# Altium project CP100-(5V1A)_V1.0.PrjPCB
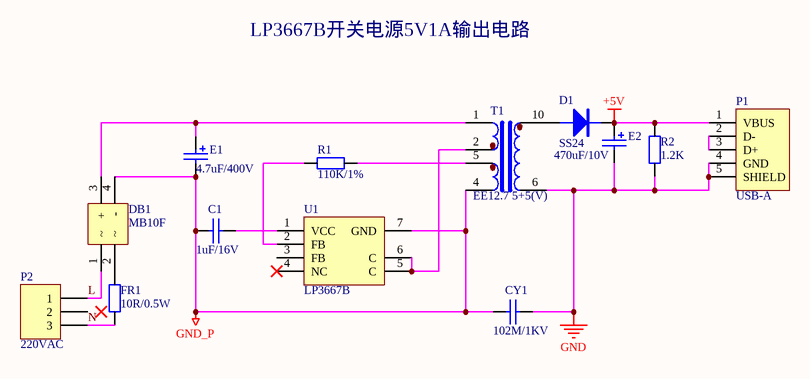
[diagram p0: CP100-(5V1A)_V1.0.SchDoc]
1 sheet, 13 parts. Net scope: global (net labels, ports and power ports of the same name join across sheets).
Board files: CP100-(5V1A)_V1.0.PcbDoc, CP100-(5V1A)_Weld_V1.0.PcbDoc

## Sheet CP100-(5V1A)_V1.0.SchDoc
size A4

### Parts
C1  1uF/16V  [0805_C]
CY1  102M/1KV  [CY-5MM]
D1  SS24  [DO-214AC(SMA)]
DB1  MB10F  [MB10F]
E1  4.7uF/400V  [CS_220uF/25V]
E2  470uF/10V  [CS_470uF/16V]
FR1  10R/0.5W  [R0.12L]
P1  USB-A  [USB-AF10.6/90]
P2  220VAC  [KF5.08-3P]
R1  110K/1%  [0603_RN]
R2  1.2K  [0805_R]
T1  EE12.7 5+5(V)  [EE12.7 5+5(V)]
U1  LP3667B  [SOP7]

### Nets
+5V: D1.K E2.1 P1.1(VBUS) R2.2
GND: CY1.2 E2.2 P1.4(GND) P1.5(SHIELD) R2.1 T1.6(Ns)
GND_P: C1.2 CY1.1 DB1.4(-) E1.2 T1.4(Nd) U1.7(GND)
L: DB1.1 P2.1
N: FR1.2 P2.3
NetC1_1: C1.1 U1.1(VCC)
NetD1_A: D1.A T1.10(Ns)
NetDB1_2: DB1.2 FR1.1
NetDB1_3: DB1.3(+) E1.1 T1.1(Np)
NetP1_2: P1.2(D-) P1.3(D+)
NetR1_1: R1.1 U1.2(FB)
NetR1_2: R1.2 T1.5(Nd)
NetT1_2: T1.2(Np) U1.5(C) U1.6(C)

Not connected (* = marked no-connect by the designer): P2 2; U1 3(FB) 4(NC)*

### Notes on the sheet
- LP3667B开关电源5V1A输出电路

### Library data of the parts
C1 CY1 = Cap1
D1 = Diode-A: SS14,SS24,SS34,M7
DB1 = MB10F: component: Bridge Rectifiers; withstand voltage: 1000V; output current: 1A
E1 E2 = Cap Pol1: CS_100uF/16V: D=5mm , PIN Spacing= 2mm; CS_1000uF/16V: D=10mm , PIN Spacing= 3.5mm; CS_470uF/16V: D=8mm , PIN Spacing= 3.5mm; CS_100uF/25V: D=6.3mm , PIN Spacing= 2.5mm; CS_470uF/25V: D=10mm , PIN Spacing= 3.5mm; CS_1000uF/25V: D=10mm , PIN Spacing= 3.5mm; CS_220uF/25V: D=8mm , PIN Spacing= 3.5mm; CS_220uF/16V: D=6.3mm , PIN Spacing= 2.5mm; CS_47uF/25V: D=5mm , PIN Spacing= 2mm
FR1 R1 R2 = Res1: Name: Resistor; Power: 0210(1/20W 25V), 0402(1/16W  50V),0603(1/16W  50V),0805(1/10W  150V),1206(1/8W  200V),1210(1/4W  200V),1812(1/2W  200V),2010(1/2W  200V),2512(1W  200V),
P2 = Header 3: Header, 3-Pin; LatestRevisionDate: 17-Jul-2002; LatestRevisionNote: Re-released for DXP Platform.; Publisher: Altium Limited
U1 = LP3667B: LP3667A, LP3667B, LP3667AH, LP3667BH